# Altium schematic sheet Motor Interface.SchDoc
size A4
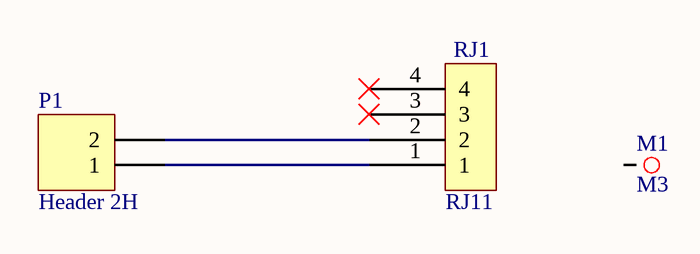
[diagram p0: Motor Interface.SchDoc]

## Parts
M1  M3  [M]
P1  Header 2H  [IO/1]
RJ1  RJ11  [IO/2]

## Nets
NetP1_1: P1.1 RJ1.1
NetP1_2: P1.2 RJ1.2

Not connected (* = marked no-connect by the designer): M1 0; RJ1 3* 4*

## Library data of the parts
P1 = Header 2H: Header, 2-Pin, Right Angle; LatestRevisionDate: 17-Jul-2002; LatestRevisionNote: Re-released for DXP Platform.; Publisher: Altium Limited